# EAGLE design lock_r3 (EAGLE 4.13)
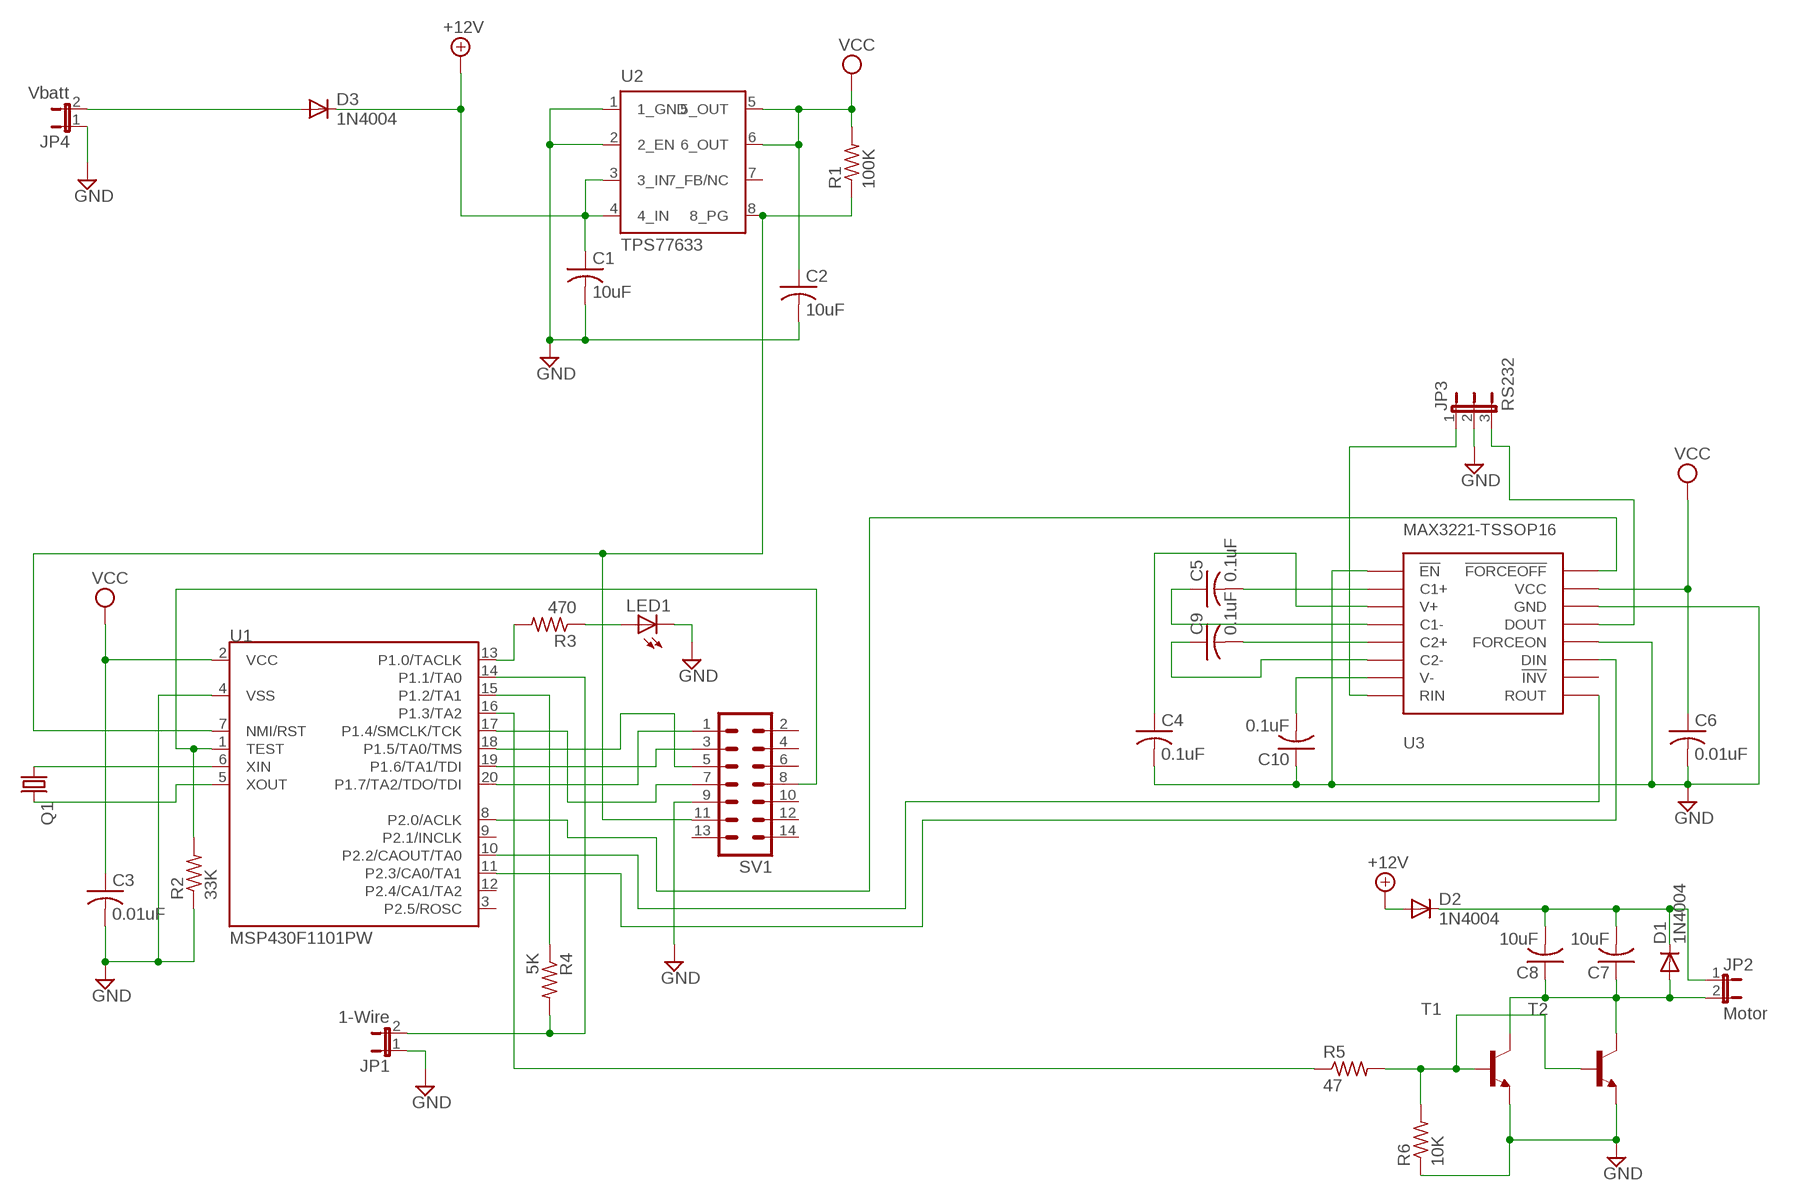
[diagram p0: schematic, sheet 1]

## Parts
C1  10uF  C-USC1206  [C1206]
C2  10uF  C-USC1206  [C1206]
C3  0.01uF  C-USC0603  [C0603]
C4  0.1uF  C-USC0603  [C0603]
C5  0.1uF  C-USC0603  [C0603]
C6  0.01uF  C-USC0603  [C0603]
C7  10uF  C-USC1206  [C1206]
C8  10uF  C-USC1206  [C1206]
C9  0.1uF  C-USC0603  [C0603]
C10  0.1uF  C-USC0603  [C0603]
D1  1N4004  [DO41-10]
D2  1N4004  [DO41-10]
D3  1N4004  [DO41-10]
JP1  1-Wire  JP1E  [JP1]
JP2  Motor  JP1E  [JP1]
JP3  RS232  JP2E  [JP2]
JP4  Vbatt  JP1E  [JP1]
LED1  LED5MM  [LED5MM]
Q1  CRYTALTC26H  [TC26H]
R1  100K  R-US_R0603  [R0603]
R2  33K  R-US_R0603  [R0603]
R3  470  R-US_R0603  [R0603]
R4  5K  R-US_R0603  [R0603]
R5  47  R-US_R0603  [R0603]
R6  10K  R-US_R0603  [R0603]
SV1  MA07-2  [MA07-2]
T1  2N5401-NPN-TO92-CBE  [TO92-CBE]
T2  2N5401-NPN-TO92-CBE  [TO92-CBE]
U1  MSP430F1101PW  [SO-20(PW)]
U2  TPS77633  [R-PDSO-G08]
U3  MAX3221-TSSOP16  [TSSOP16]

## Nets
+12V: C1.1 D2.A D3.C U2.3(3_IN) U2.4(4_IN)
GND: C1.2 C2.2 C3.2 C4.2 C6.2 C10.1 JP1.1 JP3.2 JP4.1 LED1.K(C) R2.1 R6.1 SV1.9 T1.E T2.E U1.4(VSS) U2.1(1_GND) U2.2(2_EN) U3.1(!EN) U3.12(FORCEON) U3.14(GND)
N$1: D3.A JP4.2
N$2: Q1.1 U1.6(XIN)
N$3: R1.1 SV1.11 U1.7(NMI/RST) U2.8(8_PG)
N$5: Q1.2 U1.5(XOUT)
N$6: SV1.1 U1.20(P1.7/TA2/TDO/TDI)
N$7: SV1.3 U1.19(P1.6/TA1/TDI)
N$8: SV1.5 U1.18(P1.5/TA0/TMS)
N$9: SV1.7 U1.17(P1.4/SMCLK/TCK)
N$11: R2.2 SV1.8 U1.1(TEST)
N$12: JP1.2 R4.2 U1.14(P1.1/TA0)
N$13: C5.2 U3.2(C1+)
N$14: C5.1 U3.4(C1-)
N$15: C9.2 U3.5(C2+)
N$16: C9.1 U3.6(C2-)
N$17: R4.1 U1.15(P1.2/TA1)
N$18: R3.2 U1.13(P1.0/TACLK)
N$19: LED1.A R3.1
N$20: C7.2 C8.2 D1.C D2.C JP2.1
N$22: C7.1 C8.1 D1.A JP2.2 T1.C T2.C
N$23: R5.2 R6.2 T1.B T2.B
N$25: R5.1 U1.16(P1.3/TA2)
N$27: U1.8(P2.0/ACLK) U3.16(!FORCEOFF)
N$30: C10.2 U3.7(V-)
N$32: C4.1 U3.3(V+)
N$34: JP3.1 U3.8(RIN)
N$35: JP3.3 U3.13(DOUT)
N$36: U1.10(P2.2/CAOUT/TA0) U3.9(ROUT)
N$37: U1.11(P2.3/CA0/TA1) U3.11(DIN)
VCC: C2.1 C3.1 C6.1 R1.2 U1.2(VCC) U2.5(5_OUT) U2.6(6_OUT) U3.15(VCC)
Unconnected: SV1.2 SV1.4 SV1.6 SV1.10 SV1.12 SV1.13 SV1.14 U1.3(P2.5/ROSC) U1.9(P2.1/INCLK) U1.12(P2.4/CA1/TA2) U2.7(7_FB/NC) U3.10(!INV)

## Library data of the parts
C1-C10 = rcl:C-US: CAPACITOR, American symbol
D1-D3 = diode:1N4004: DIODE general purpose rectifier, 1 A
JP1 JP2 JP4 = jumper:JP1E: JUMPER
JP3 = jumper:JP2E: JUMPER
LED1 = led:LED: LED OSRAM: - CHIPLED LG R971, LG N971, LY N971, LG Q971, LY Q971, LO R971, LY R971 LH N974, LH R974 LS Q976, LO Q976, LY Q976 LO Q996 - Hyper CHIPLED LW Q18S LB Q993, LB Q99A, LB R99A - SideLED LS A670, LO A670, LY A670, LG A670, LP A670 LB A673, LV A673, LT A673, LW A673 LH A674 LY A675 LS A676, LA A676, LO A676, LY A676, LW A676 LS A679, LY A679, LG A679 - Hyper Micro SIDELED® LS Y876, LA Y876, LO Y876, LY Y876 LT Y87S - SmartLED LW L88C, LW L88S LB L89C, LB L89S, LG L890 LS L89K, LO L89K, LY L89K LS L896, LA L896, LO L896, LY L896 - TOPLED LS T670, LO T670, LY T670, LG T670, LP T670 LSG T670, LSP T670, LSY T670, LOP T670, LYG T670 LG T671, LOG T671, LSG T671 LB T673, LV T673, LT T673, LW T673 LH T674 LS T676, LA T676, LO T676, LY T676, LB T676, LH T676, LSB T676, LW T676 LB T67C, LV T67C, LT T67C, LS T67K, LO T67K, LY T67K, LW E67C LS E67B, LA E67B, LO E67B, LY E67B, LB E67C, LV E67C, LT E67C LW T67C LS T679, LY T679, LG T679 LS T770, LO T770, LY T770, LG T770, LP T770 LB T773, LV T773, LT T773, LW T773 LH T774 LS E675, LA E675, LY E675, LS T675 LS T776, LA T776, LO T776, LY T776, LB T776 LHGB T686 LT T68C, LB T68C - Hyper Mini TOPLED® LB M676 - Mini TOPLED Santana® LG M470 LS M47K, LO M47K, LY M47K Source: http://www.osram.convergy.de/
Q1 = crystal:CRYTAL: CRYSTAL
R1-R6 = rcl:R-US_: RESISTOR, American symbol
SV1 = con-lstb:MA07-2: PIN HEADER
T1 T2 = transistor:*-NPN-: NPN Transistror
U1 = msp430:MSP430F11*1: MIXED SIGNAL MICROCONTROLLER 16bit, ultra low power
U2 = tps77633:TPS77633
U3 = texas-msp:MAX3221

## Board
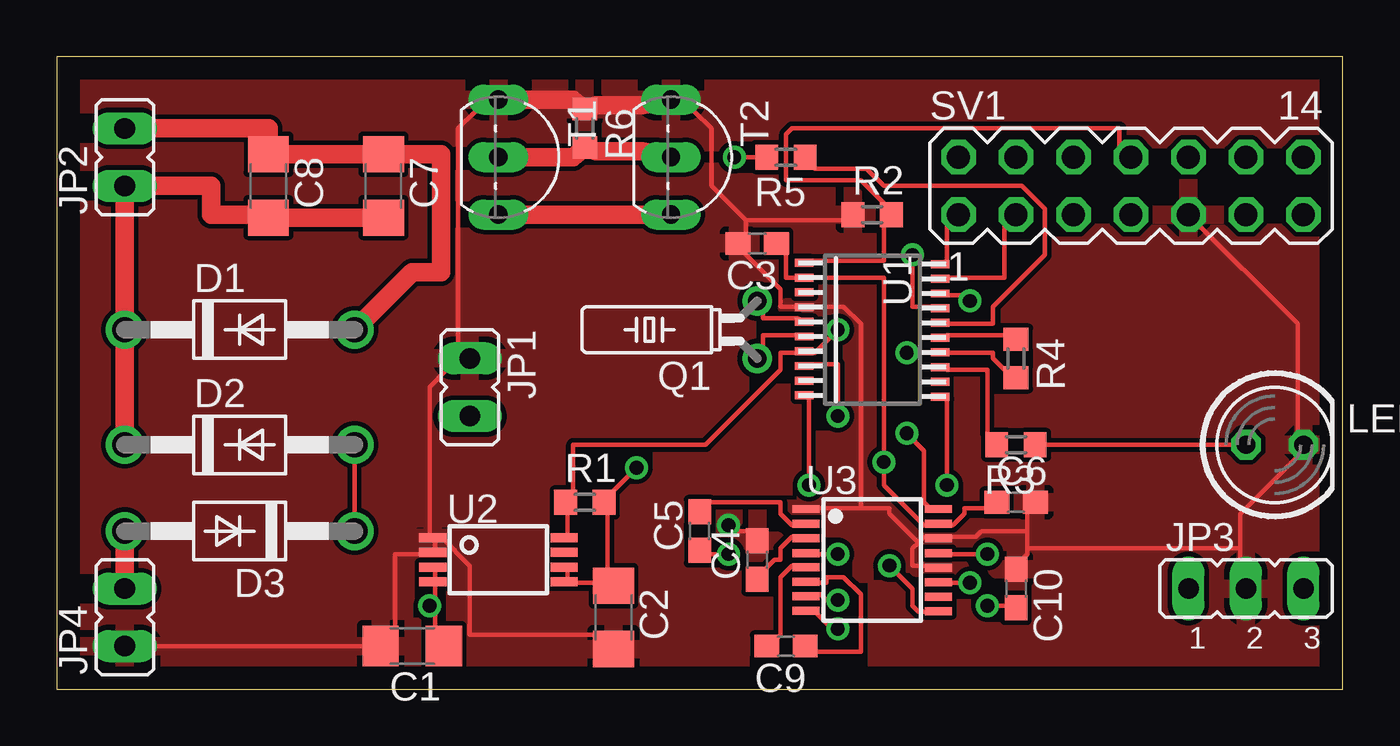
[diagram p1: board, top side]
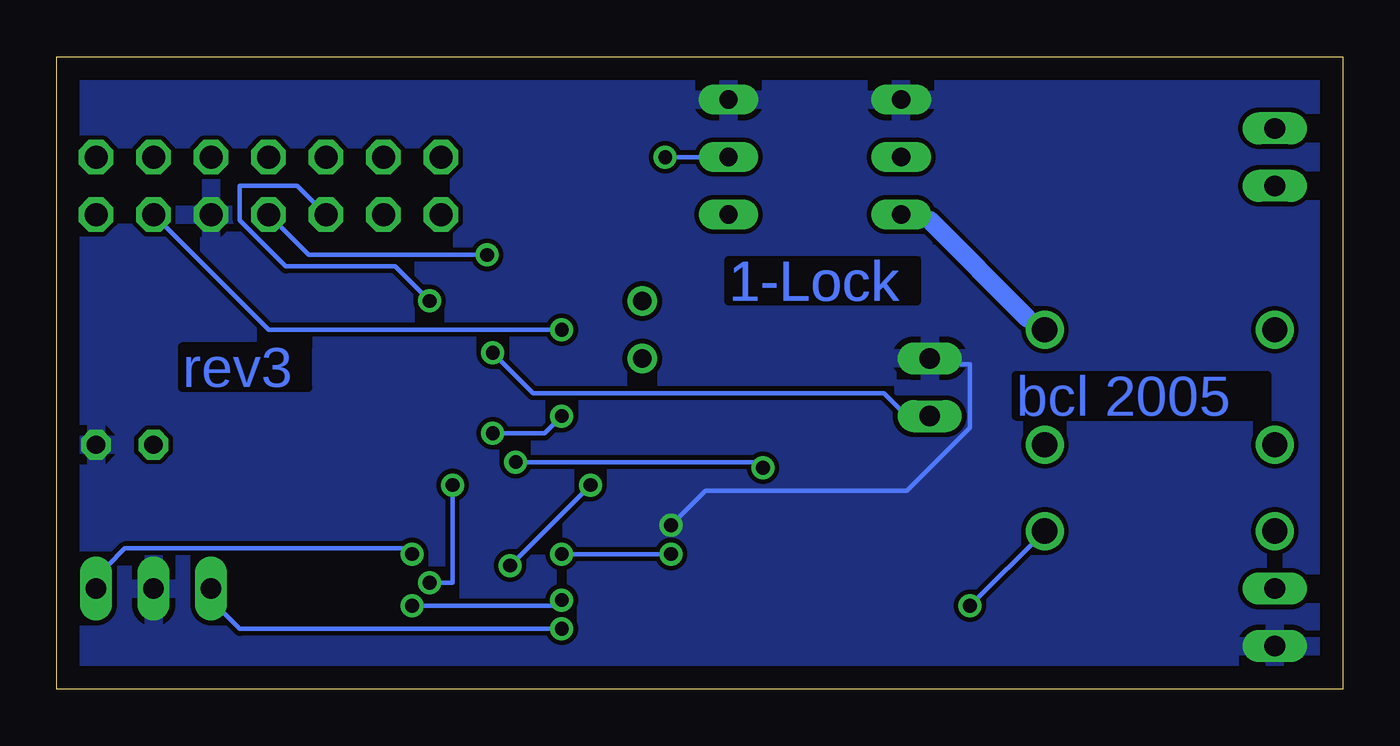
[diagram p2: board, bottom side, seen from below]

Size 56.82 x 27.93 mm. Coordinates in mm from the lower left corner, seen from the top.
Outline: 0,0 56.82,0 56.82,27.93 0,27.93 0,0
Copper layers (1*16): Top 0.035mm / dielectric 1.5mm / Bottom 0.035mm
Design rules "default": minimum track width 8mil, minimum drill 24mil, track to track 8mil, track to pad 8mil, pad to pad 8mil, via to via 8mil, smd to smd 8mil, copper to edge 40mil, drill to drill 8mil, minimum pad ring 10mil, minimum via ring 8mil, stop-mask expansion 4mil, vias tented up to drill 0mil, thermal gap 10mil

### Footprints (pad centres in the part's own frame; a part is rotated, then mirrored left to right if it is on the bottom)
C1206 = smd 1.6 x 1.8: 1 -1.4,0; 2 1.4,0
C0603 = smd 1.1 x 1: 1 -0.85,0; 2 0.85,0
DO41-10 = drill 1.118 round: A 5.08,0; C -5.08,0
JP1 = drill 0.914 long: 1 0,-1.27; 2 0,1.27
JP2 = drill 0.914 long: 1 -2.54,0; 2 0,0; 3 2.54,0
LED5MM = drill 0.813 octagon: A -1.27,0; K 1.27,0
TC26H = drill 0.813 round: 1 -1.27,0; 2 1.27,0
R0603 = smd 1 x 1.1: 1 -0.85,0; 2 0.85,0
MA07-2 = drill 1.016 octagon: 1 -7.62,-1.27; 2 -7.62,1.27; 3 -5.08,-1.27; 4 -5.08,1.27; 5 -2.54,-1.27; 6 -2.54,1.27; 7 0,-1.27; 8 0,1.27; 9 2.54,-1.27; 10 2.54,1.27; 11 5.08,-1.27; 12 5.08,1.27; 13 7.62,-1.27; 14 7.62,1.27
TO92-CBE = drill 0.813 long: B 0,0; C 2.54,0; E -2.54,0
SO-20(PW) = smd 0.35 x 0.813: 1 -2.95,-3; 2 -2.3,-3; 3 -1.65,-3; 4 -1,-3; 5 -0.35,-3; 6 0.3,-3; 7 0.95,-3; 8 1.6,-3; 9 2.25,-3; 10 2.9,-3; 11 2.95,3; 12 2.3,3; 13 1.65,3; 14 1,3; 15 0.35,3; 16 -0.3,3; 17 -0.95,3; 18 -1.6,3; 19 -2.25,3; 20 -2.9,3
R-PDSO-G08 = smd 1.2 x 0.4: 1 -2.9,0.975; 2 -2.9,0.325; 3 -2.9,-0.325; 4 -2.9,-0.975; 5 2.9,-0.975; 6 2.9,-0.325; 7 2.9,0.325; 8 2.9,0.975
TSSOP16 = smd 0.35 x 1.2: 1 -0.975,-2.925; 2 -0.325,-2.925; 3 0.325,-2.925; 4 0.975,-2.925; 5 1.605,-2.925; 6 2.245,-2.925; 7 2.885,-2.925; 8 3.525,-2.925; 9 3.535,2.925; 10 2.895,2.925; 11 2.255,2.925; 12 1.615,2.925; 13 0.975,2.925; 14 0.325,2.925; 15 -0.325,2.925; 16 -0.975,2.925

### Placement (x,y rotation side)
C1  15.71,1.9 180 top
C2  24.6,3.17 270 top
C3  30.95,19.68 180 top
C4  30.95,5.71 90 top
C5  28.41,6.98 90 top
C6  42.38,8.25 0 top
C7  14.44,22.22 270 top
C8  9.36,22.22 270 top
C9  32.22,1.9 180 top
C10  42.38,4.44 270 top
D1  8.09,15.87 0 top
D2  8.09,10.79 0 top
D3  8.09,6.98 180 top
JP1  18.25,13.33 180 top
JP2  3.01,23.49 0 top
JP3  52.54,4.44 0 top
JP4  3.01,3.17 0 top
LED1  53.81,10.79 0 top
Q1  30.95,15.87 90 top
R1  23.33,8.25 0 top
R2  36.03,20.95 0 top
R3  42.38,10.79 180 top
R4  42.38,14.6 270 top
R5  32.22,23.49 180 top
R6  23.33,24.76 270 top
SV1  47.46,22.22 0 top
T1  19.52,23.49 270 top
T2  27.14,23.49 270 top
U1  36.03,15.87 270 top
U2  19.52,5.71 0 top
U3  36.03,6.98 270 top

### Tracks (layer width: path | path; a pad name or v marks a point on that pad's centre or on a via)
+12V  (via drill 0.61)
  Top 0.203: 16.73,4.69 16.73,5.2 U2.3 | 16.73,3.68 16.73,2.66 C1.1 | 16.73,3.68 16.73,4.69 | 16.73,4.69 U2.4 | 16.73,3.68 v16.47,3.68 | D3.C D2.A
  Bottom 0.203: v16.47,3.68 D3.C
GND  (via drill 0.61)
  Top 0.203: 38.06,6.47 38.32,6.73 38.57,6.73 U3.14 39.33,6.73 40.6,6.73 40.86,6.98 42.89,6.98 | 38.06,6.47 37.81,6.22 37.81,5.46 38.57,5.46 U3.12 | 35.52,8 36.79,8 36.79,7.74 38.06,6.47 | 35.52,8 33.49,8 U3.1 | 42.89,6.98 42.89,8 C6.2 | 42.89,6.98 42.89,6.22 | 42.89,6.22 42.89,5.96 42.63,5.71 C10.1 | 42.89,6.22 52.29,6.22 | 52.29,6.22 52.29,5.71 JP3.2 | 52.29,6.22 52.29,7.74 54.83,10.28 LED1.K 54.83,11.3 54.83,16.12 SV1.9 | 30.44,20.7 34.76,20.7 R2.1 | 30.44,20.7 30.44,19.93 C3.2 30.44,19.43 30.44,19.17 31.97,17.65 31.97,16.89 32.73,16.89 U1.4 33.24,16.89 34.76,16.89 35.52,16.12 35.52,8 | 30.44,20.7 28.92,22.22 28.92,24.76 28.16,25.52 T2.E | v29.68,7.23 29.68,6.98 30.7,6.98 C4.2 | U2.1 16.73,6.73 16.73,6.22 U2.2 16.22,5.96 14.95,5.96 14.95,2.66 C1.2 JP4.1 | C2.2 23.84,2.41 18.25,2.41 18.25,5.46 16.98,6.73 U2.1 | U2.1 16.47,6.73 16.47,13.33 17.23,14.09 JP1.1 17.74,15.11 17.74,24.76 18.5,25.52 T1.E
  Top 0.813: T2.E 25.87,25.78 23.84,25.78 R6.1 22.82,26.03 T1.E
  Bottom 0.203: v29.68,7.23 28.16,8.76 19.27,8.76 16.47,11.55 16.47,14.35 16.98,14.35 JP1.1
  pour Bottom: 0.47,27.3 0.47,0.63 56.35,0.63 56.35,27.3
  pour Top: 0.47,27.3 0.47,0.63 56.35,0.63 56.35,27.3
N$1
  Top 0.813: JP4.2 D3.A
N$2
  Top 0.203: U1.6 32.73,15.62 31.2,15.62 31.2,15.11 Q1.1
N$3  (via drill 0.61)
  Top 0.203: U2.8 22.57,6.73 22.57,7.74 R1.1 22.82,8.76 22.82,10.79 28.66,10.79 31.97,14.09 31.97,14.85 32.73,14.85 U1.7 33.24,14.85 33.49,14.85 v34.51,15.87
  Bottom 0.203: v34.51,15.87 47.46,15.87 SV1.11
N$5
  Top 0.203: U1.5 32.73,16.38 31.2,16.38 31.2,16.63 Q1.2
N$6
  Top 0.203: U1.20 39.33,18.92 39.33,20.44 SV1.1
N$7
  Top 0.203: U1.19 39.33,18.16 41.87,18.16 41.87,20.44 SV1.3
N$8  (via drill 0.61)
  Top 0.203: v40.35,17.14 40.35,17.39 39.33,17.39 U1.18
  Bottom 0.203: v40.35,17.14 41.87,18.66 46.7,18.66 48.73,20.7 48.73,22.22 46.19,22.22 SV1.5
N$9  (via drill 0.61)
  Top 0.203: v37.81,19.17 37.81,16.89 38.82,16.89 U1.17
  Bottom 0.203: v37.81,19.17 45.68,19.17 SV1.7
N$11
  Top 0.203: U1.1 33.24,18.92 36.54,18.92 36.54,20.44 R2.2 36.54,21.46 35.52,22.47 32.22,22.47 32.22,24.51 32.47,24.76 46.95,24.76 46.95,24 SV1.8
N$12  (via drill 0.61)
  Top 0.203: R4.2 41.87,14.09 41.36,14.6 41.36,14.85 39.33,14.85 U1.14 38.82,14.85 v37.55,14.85
  Bottom 0.203: v37.55,14.85 35.78,13.08 20.28,13.08 19.52,12.31 JP1.2
N$13
  Top 0.203: C5.2 28.66,8.25 31.97,8.25 31.97,7.74 32.47,7.23 32.73,7.23 U3.2
N$14  (via drill 0.61)
  Top 0.203: v29.68,5.96 28.66,5.96 C5.1 | v34.51,5.96 33.49,5.96 U3.4
  Bottom 0.203: v29.68,5.96 v34.51,5.96
N$15
  Top 0.203: C9.2 31.71,2.15 31.97,2.41 31.97,4.95 32.47,5.46 32.73,5.46 U3.5
N$16
  Top 0.203: C9.1 33.49,1.65 35.52,1.65 35.52,4.19 34.76,4.95 34,4.95 34,4.69 33.49,4.69 U3.6
N$17
  Top 0.203: U1.15 39.33,15.62 41.87,15.62 R4.1
N$18
  Top 0.203: U1.13 39.33,14.09 41.11,14.09 41.11,11.3 R3.2
N$19
  Top 0.203: R3.1 LED1.A
N$20
  Top 0.813: D2.C D1.C JP2.1 6.82,22.22 6.82,20.95 9.36,20.95 C8.2 C7.2 14.44,20.95
N$22
  Top 0.813: T1.C T2.C | JP2.2 9.36,24.76 C8.1 | C8.1 9.36,23.49 | C8.1 C7.1 | C7.1 14.44,23.49 | C7.1 16.98,23.62 16.98,18.41 15.71,18.41 D1.A
  Bottom 0.203: 13.93,16.38 13.68,16.38 D1.A | 18.25,20.7 T1.C
  Bottom 0.813: 13.93,16.38 18.25,20.7
N$23  (via drill 0.61)
  Top 0.203: v29.93,23.49 R5.2
  Top 0.813: T2.B 25.87,23.74 23.84,23.74 R6.2 22.82,23.49 T1.B
  Bottom 0.203: T2.B v29.93,23.49
N$25
  Top 0.203: U1.16 39.33,16.12 41.36,16.12 41.36,16.89 43.65,19.17 43.65,21.2 42.63,22.22 36.54,22.22 35.78,22.98 33.49,22.98 R5.1
N$27  (via drill 0.61)
  Top 0.203: v34.51,12.06 34.51,14.35 33.24,14.35 U1.8 | v37.55,11.3 38.32,10.54 38.32,8.25 38.57,8 U3.16
  Bottom 0.203: v34.51,12.06 35.27,11.3 v37.55,11.3
N$30  (via drill 0.61)
  Top 0.203: v41.11,3.68 42.13,3.68 C10.2 | v34.51,3.93 34,3.93 33.74,4.19 33.49,4.19 U3.7
  Bottom 0.203: v41.11,3.68 34.76,3.68 v34.51,3.93
N$32
  Top 0.203: C4.1 31.2,5.2 31.71,5.71 31.97,5.71 31.97,6.22 32.47,6.73 32.73,6.73 U3.3
N$34  (via drill 0.61)
  Top 0.203: v34.51,2.66 34.25,2.66 33.49,3.42 U3.8
  Bottom 0.203: v34.51,2.66 48.73,2.66 49.49,3.42 JP3.1
N$35  (via drill 0.61)
  Top 0.203: v41.11,5.96 39.33,5.96 U3.13
  Bottom 0.203: v41.11,5.96 41.36,6.22 53.81,6.22 54.57,5.46 JP3.3
N$36  (via drill 0.61)
  Top 0.203: v33.24,9.01 33.24,12.82 U1.10 | v36.79,5.46 37.81,4.44 37.81,3.68 38.06,3.42 38.57,3.42 U3.9
  Bottom 0.203: v36.79,5.46 v33.24,9.01
N$37  (via drill 0.61)
  Top 0.203: v39.33,9.01 39.33,12.82 U1.11 | v40.35,4.69 39.33,4.69 U3.11
  Bottom 0.203: v39.33,9.01 39.33,4.69 v40.35,4.69
VCC  (via drill 0.61)
  Top 0.203: U2.6 22.57,5.2 22.57,4.69 U2.5 22.82,4.69 23.84,4.69 C2.1 24.35,5.2 24.35,7.74 R1.2 24.6,8.76 v25.62,9.77 | C3.1 32.22,19.43 32.22,18.16 32.73,18.16 U1.2 33.24,18.16 36.54,18.16 v36.54,10.03 36.54,9.01 38.32,7.23 38.57,7.23 U3.15 39.33,7.23 39.59,7.23 40.09,7.74 40.09,8 41.11,8 C6.1
  Bottom 0.203: v25.62,9.77 25.87,10.03 v36.54,10.03

### Text on the board
Bottom: 1-Lock | 1-Lock | 1-Lock | rev3 | bcl 2005